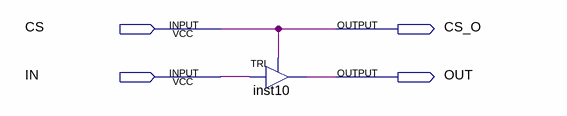
[diagram p0: schematic sheet]
// Quartus schematic EEPROM_1bit.bdf as structural Verilog: 1 symbols, 4 pins
module EEPROM_1bit (
  input  CS,
  input  IN,
  output CS_O,
  output OUT
);

  TRI inst10 (.IN(IN), .OE(CS), .OUT(OUT));

  assign CS_O = CS;
endmodule
